# EAGLE design Daughter Board V2 (EAGLE 9.1.3)
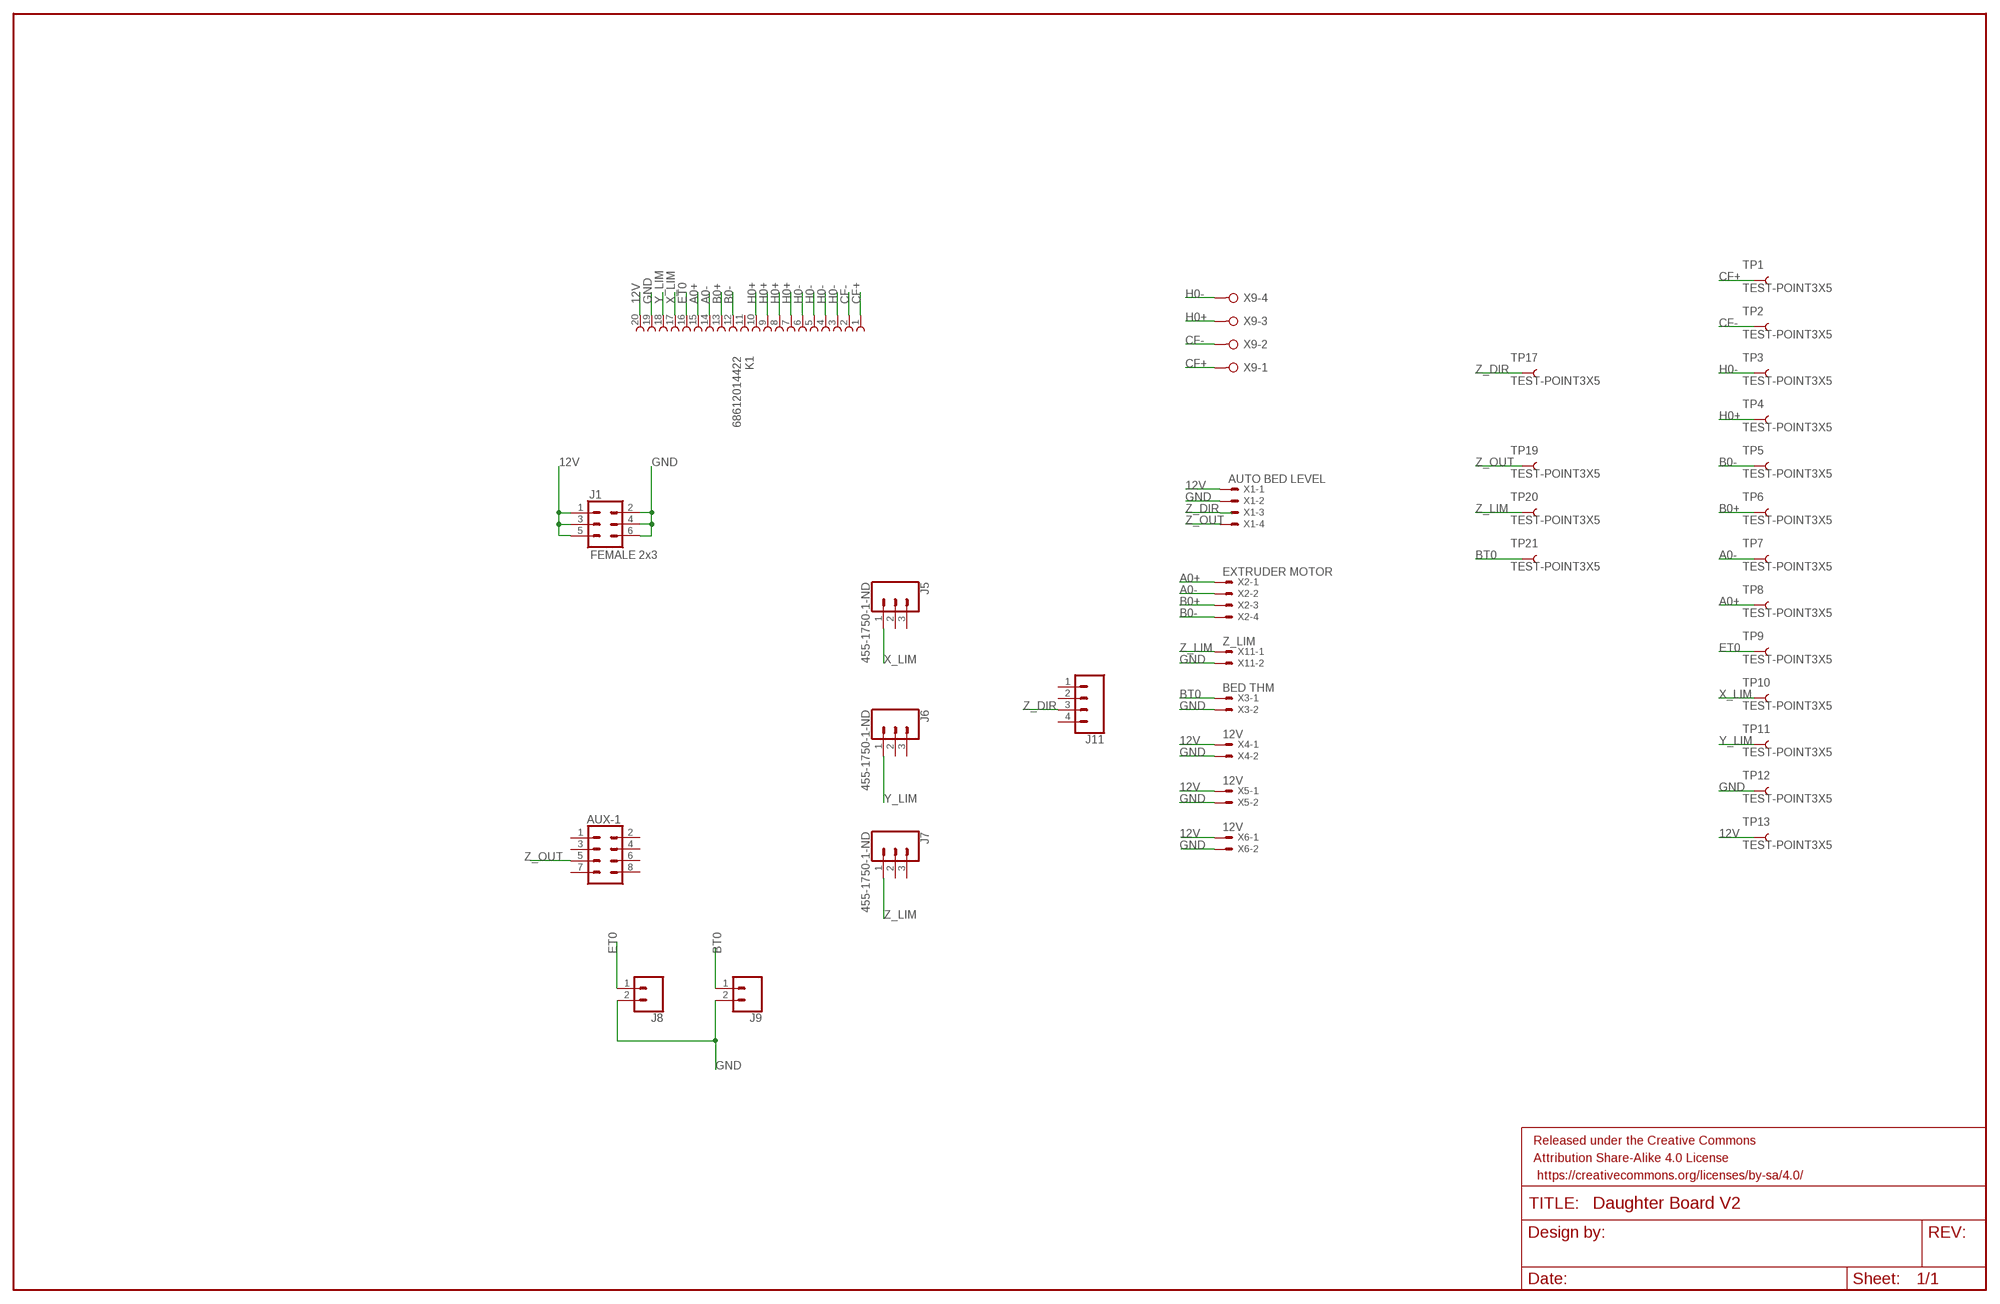
[diagram p0: schematic, sheet 1]

## Parts
AUX-1  CONN_04X2  [2X4]
FRAME1  FRAME-LEDGER  [CREATIVE_COMMONS]
J1  FEMALE 2x3  CONN_03X2FEMALE  [2X3]
J5  455-1750-1-ND  CONN_03  [1X03]
J6  455-1750-1-ND  CONN_03  [1X03]
J7  455-1750-1-ND  CONN_03  [1X03]
J8  CONN_02  [1X02]
J9  CONN_02  [1X02]
J11  CONN_04  [1X04]
K1  68612014422  [68612014422]
TP1  TEST-POINT3X5  [PAD.03X.05]
TP2  TEST-POINT3X5  [PAD.03X.05]
TP3  TEST-POINT3X5  [PAD.03X.05]
TP4  TEST-POINT3X5  [PAD.03X.05]
TP5  TEST-POINT3X5  [PAD.03X.05]
TP6  TEST-POINT3X5  [PAD.03X.05]
TP7  TEST-POINT3X5  [PAD.03X.05]
TP8  TEST-POINT3X5  [PAD.03X.05]
TP9  TEST-POINT3X5  [PAD.03X.05]
TP10  TEST-POINT3X5  [PAD.03X.05]
TP11  TEST-POINT3X5  [PAD.03X.05]
TP12  TEST-POINT3X5  [PAD.03X.05]
TP13  TEST-POINT3X5  [PAD.03X.05]
TP17  TEST-POINT3X5  [PAD.03X.05]
TP19  TEST-POINT3X5  [PAD.03X.05]
TP20  TEST-POINT3X5  [PAD.03X.05]
TP21  TEST-POINT3X5  [PAD.03X.05]
X1  AUTO BED LEVEL  JST-XH-04-PIN-LONG-PAD  [JST-XH-04-PACKAGE-LONG-PAD]
X2  EXTRUDER MOTOR  JST-XH-04-PIN-LONG-PAD  [JST-XH-04-PACKAGE-LONG-PAD]
X3  BED THM  JST-XH-02-PIN-LONG-PAD  [JST-XH-02-PACKAGE-LONG-PAD]
X4  12V  JST-XH-02-PIN-LONG-PAD  [JST-XH-02-PACKAGE-LONG-PAD]
X5  12V  JST-XH-02-PIN-LONG-PAD  [JST-XH-02-PACKAGE-LONG-PAD]
X6  12V  JST-XH-02-PIN-LONG-PAD  [JST-XH-02-PACKAGE-LONG-PAD]
X9  W237-04P  [W237-4P]
X11  Z_LIM  JST-XH-02-PIN-LONG-PAD  [JST-XH-02-PACKAGE-LONG-PAD]

## Nets
12V: J1.1 J1.3 J1.5 K1.20 TP13.P$1 X1.1 X4.1 X5.1 X6.1
A0+: K1.15 TP8.P$1 X2.1
A0-: K1.14 TP7.P$1 X2.2
B0+: K1.13 TP6.P$1 X2.3
B0-: K1.12 TP5.P$1 X2.4
BT0: J9.1 TP21.P$1 X3.1
CF+: K1.1 TP1.P$1 X9.1
CF-: K1.2 TP2.P$1 X9.2
ET0: J8.1 K1.16 TP9.P$1
GND: J1.2 J1.4 J1.6 J8.2 J9.2 K1.19 TP12.P$1 X1.2 X3.2 X4.2 X5.2 X6.2 X11.2
H0+: K1.7 K1.8 K1.9 K1.10 TP4.P$1 X9.3
H0-: K1.3 K1.4 K1.5 K1.6 TP3.P$1 X9.4
X_LIM: J5.1 K1.17 TP10.P$1
Y_LIM: J6.1 K1.18 TP11.P$1
Z_DIR: J11.3 TP17.P$1 X1.3
Z_LIM: J7.1 TP20.P$1 X11.1
Z_OUT: AUX-1.5 TP19.P$1 X1.4
Unconnected: AUX-1.1 AUX-1.2 AUX-1.3 AUX-1.4 AUX-1.6 AUX-1.7 AUX-1.8 J5.2 J5.3 J6.2 J6.3 J7.2 J7.3 J11.1 J11.2 J11.4 K1.11

## Library data of the parts
AUX-1 = SparkFun-Connectors:CONN_04X2: Multi connection point. Often used as Generic Header-pin footprint for 0.1 inch spaced/style header connections On any of the 0.1 inch spaced packages, you can populate with these: Break Away Headers - Straight <https://www.sparkfun.com/products/116> (PRT-00116) Break Away Male Headers - Right Angle <https://www.sparkfun.com/products/553> (PRT-00553) Female Headers <https://www.sparkfun.com/products/115> (PRT-00115) Break Away Headers - Machine Pin <https://www.sparkfun.com/products/117> (PRT-00117) Break Away Female Headers - Swiss Machine Pin <https://www.sparkfun.com/products/743> (PRT-00743)
FRAME1 = SparkFun-Aesthetics:FRAME-LEDGER: Schematic Frame - Ledger Standard 11x14 US Ledger frame
J1 = SparkFun-Connectors:CONN_03X2: Multi connection point. Often used as Generic Header-pin footprint for 0.1 inch spaced/style header connections You can populate with any combo of single row headers, but if you'd like an exact match, check these: Header - 2x3 (Male, 0.1") <https://www.sparkfun.com/products/12807> (PRT-12807) Header - 2x3 (Female, 0.1") <https://www.sparkfun.com/products/13010> (PRT-13010) 2x3 Pin Shrouded Header <https://www.sparkfun.com/products/10877> (PRT-10877) On any of the 0.1 inch spaced packages, you can populate with these: Break Away Headers - Straight <https://www.sparkfun.com/products/116> (PRT-00116) Break Away Male Headers - Right Angle <https://www.sparkfun.com/products/553> (PRT-00553) Female Headers <https://www.sparkfun.com/products/115> (PRT-00115) Break Away Headers - Machine Pin <https://www.sparkfun.com/products/117> (PRT-00117) Break Away Female Headers - Swiss Machine Pin <https://www.sparkfun.com/products/743> (PRT-00743) Special note: the shrouded connector mates well with our 3x2 ribbon cables: Ribbon Crimp Connector - 6-pin (2x3, Female) <https://www.sparkfun.com/products/10651> (PRT-10651) Ribbon Cable - 6 wire (15ft) <https://www.sparkfun.com/products/10646> (PRT-10646); PROD_ID: CONN-11566
J5-J7 = SparkFun-Connectors:CONN_03: Multi connection point. Often used as Generic Header-pin footprint for 0.1 inch spaced/style header connections On any of the 0.1 inch spaced packages, you can populate with these: Break Away Headers - Straight <https://www.sparkfun.com/products/116> (PRT-00116) Break Away Male Headers - Right Angle <https://www.sparkfun.com/products/553> (PRT-00553) Female Headers <https://www.sparkfun.com/products/115> (PRT-00115) Break Away Headers - Machine Pin <https://www.sparkfun.com/products/117> (PRT-00117) Break Away Female Headers - Swiss Machine Pin <https://www.sparkfun.com/products/743> (PRT-00743) Stackable Header - 3 Pin (Female, 0.1") <https://www.sparkfun.com/products/13875> (PRT-13875) For SCREWTERMINALS and SPRING TERMINALS visit here: Screw Terimnals on SparkFun.com <https://www.sparkfun.com/search/results?term=Screw+Terminals> (5mm/3.5mm/2.54mm spacing) This device is also useful as a general connection point to wire up your design to another part of your project. Our various solder wires solder well into these plated through hole pads. Hook-Up Wire - Assortment (Stranded, 22 AWG) <https://www.sparkfun.com/products/11375> (PRT-11375) Hook-Up Wire - Assortment (Solid Core, 22 AWG) <https://www.sparkfun.com/products/11367> (PRT-11367) View the entire wire category on our website here <https://www.sparkfun.com/categories/141> Special notes: Molex polarized connector foot print use with SKU : PRT-08232 with associated crimp pins and housings.; PROD_ID: XXX-00000
J8 J9 = SparkFun-Connectors:CONN_02: Multi connection point. Often used as Generic Header-pin footprint for 0.1 inch spaced/style header connections On any of the 0.1 inch spaced packages, you can populate with these: Break Away Headers - Straight <https://www.sparkfun.com/products/116> (PRT-00116) Break Away Male Headers - Right Angle <https://www.sparkfun.com/products/553> (PRT-00553) Female Headers <https://www.sparkfun.com/products/115> (PRT-00115) Break Away Headers - Machine Pin <https://www.sparkfun.com/products/117> (PRT-00117) Break Away Female Headers - Swiss Machine Pin <https://www.sparkfun.com/products/743> (PRT-00743) For SCREWTERMINALS and SPRING TERMINALS visit here: Screw Terimnals on SparkFun.com <https://www.sparkfun.com/search/results?term=Screw+Terminals> (5mm/3.5mm/2.54mm spacing) This device is also useful as a general connection point to wire up your design to another part of your project. Our various solder wires solder well into these plated through hole pads. Hook-Up Wire - Assortment (Stranded, 22 AWG) <https://www.sparkfun.com/products/11375> (PRT-11375) Hook-Up Wire - Assortment (Solid Core, 22 AWG) <https://www.sparkfun.com/products/11367> (PRT-11367) View the entire wire category on our website here <https://www.sparkfun.com/categories/141> Special notes: Molex polarized connector foot print use with: PRT-08233 with associated crimp pins and housings. 2.54_SCREWTERM for use with PRT-10571. 3.5mm Screw Terminal footprints for PRT-08084 5mm Screw Terminal footprints for use with PRT-08432
J11 = SparkFun-Connectors:CONN_04: Multi connection point. Often used as Generic Header-pin footprint for 0.1 inch spaced/style header connections On any of the 0.1 inch spaced packages, you can populate with these: Break Away Headers - Straight <https://www.sparkfun.com/products/116> (PRT-00116) Break Away Male Headers - Right Angle <https://www.sparkfun.com/products/553> (PRT-00553) Female Headers <https://www.sparkfun.com/products/115> (PRT-00115) Break Away Headers - Machine Pin <https://www.sparkfun.com/products/117> (PRT-00117) Break Away Female Headers - Swiss Machine Pin <https://www.sparkfun.com/products/743> (PRT-00743) For SCREWTERMINALS and SPRING TERMINALS visit here: Screw Terimnals on SparkFun.com <https://www.sparkfun.com/search/results?term=Screw+Terminals> (5mm/3.5mm/2.54mm spacing) This device is also useful as a general connection point to wire up your design to another part of your project. Our various solder wires solder well into these plated through hole pads. Hook-Up Wire - Assortment (Stranded, 22 AWG) <https://www.sparkfun.com/products/11375> (PRT-11375) Hook-Up Wire - Assortment (Solid Core, 22 AWG) <https://www.sparkfun.com/products/11367> (PRT-11367) View the entire wire category on our website here <https://www.sparkfun.com/categories/141> Special notes: Molex polarized connector foot print use with SKU : PRT-08231 with associated crimp pins and housings. 1MM SMD Version SKU: PRT-10208; PROD_ID: CONN-09696
K1 = Wurth_Elektronik_Electromechanic_FPC_Connectors_&_Flat_Flexible_Cable_rev15b:68612014422: WR-FPC 1.00mm SMT ZIF Horizontal Bottom Contact, 20 Pins=>Code : Con_FPC_ZIF_1.00_68612014422 <http://katalog.we-online.de/media/images/eican/Con_FPC_ZIF_1.00_6861xx14422_pf2.jpg> Details see: http://katalog.we-online.de/en/em/686_1xx_144_22 Created 2014-07-09, Karrer Zheng 2014 (C) Würth Elektronik
TP1-TP13 TP17 TP19-TP21 = SparkFun-Connectors:TEST-POINT: SparkFun Test Points Bare copper test points for troubleshooting or In-Circuit-Testing. These are used by our Production team for verifying production board runs using pogo-pins on test beds. SparkFun Products: SparkFun LSM9DS1 Breakout <https://www.sparkfun.com/products/13284> SparkFun PSOC <https://www.sparkfun.com/products/13714> SparkFun Load Cell Amplifier <https://www.sparkfun.com/products/13879>
X1 X2 = Rembrandt Electronics - JST XH Connectors v1-0:JST-XH-04-PIN: JST XH Connector 2 Pin Wire to board connector. Pitch: 2,54 mm, (0.100") Number of pins: 4 Created by Rembrandt Electronics www.rembrandtelectronics.com
X3-X6 X11 = Rembrandt Electronics - JST XH Connectors v1-0:JST-XH-02-PIN: JST XH Connector 2 Pin Wire to board connector. Pitch: 2,54 mm, (0.100") Number of pins: 2 Created by Rembrandt Electronics www.rembrandtelectronics.com
X9 = con-wago-508:W237-04P: WAGO SREW CLAMP; OC_FARNELL: unknown; OC_NEWARK: unknown

## Net classes
0 default: width 0.406 mm

## Board
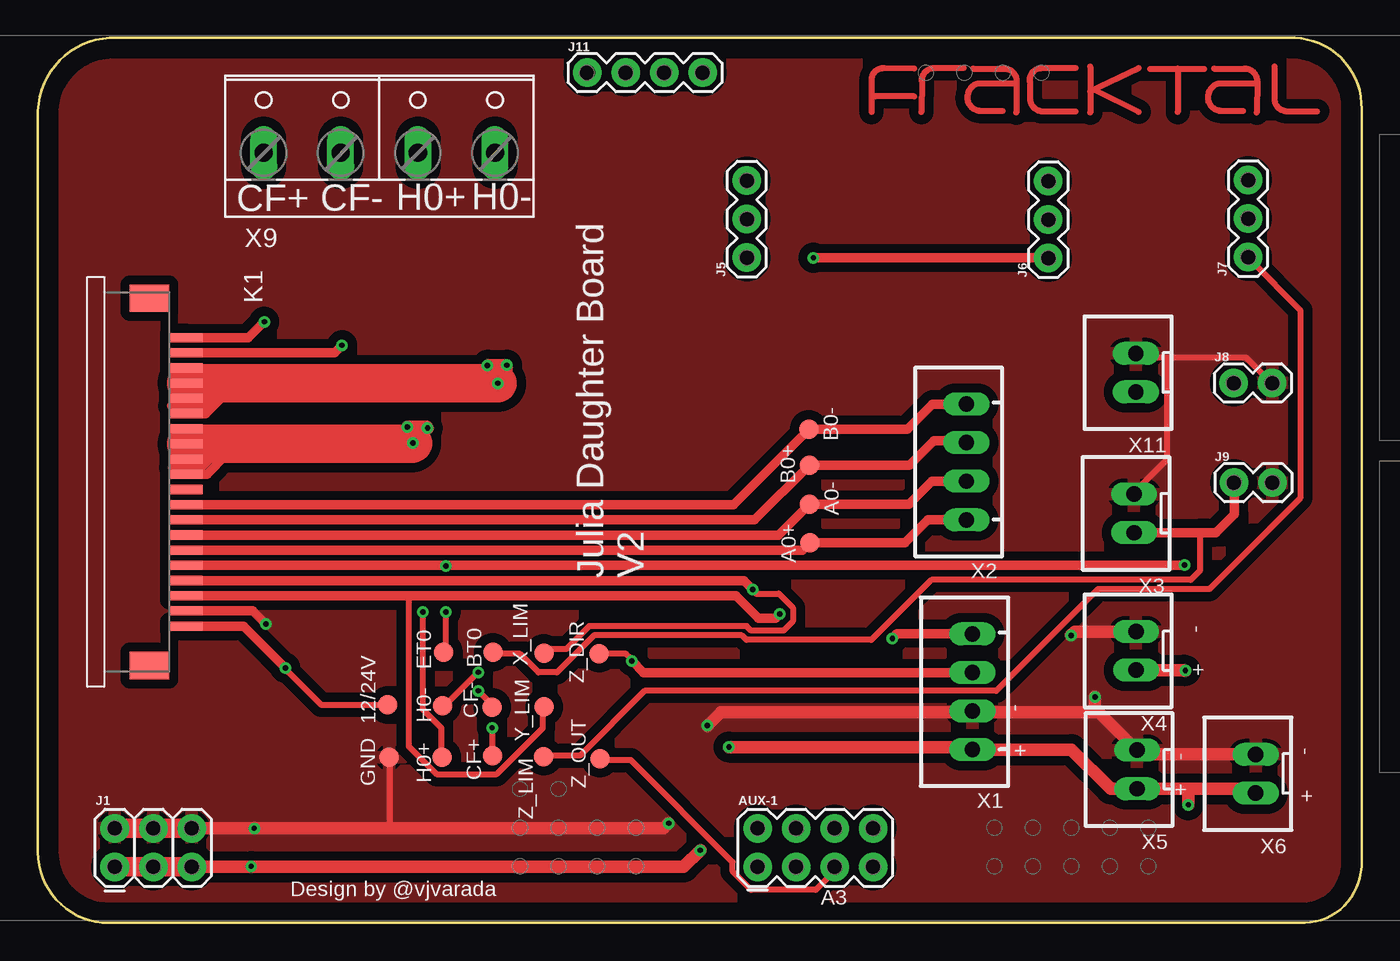
[diagram p1: board, top side]
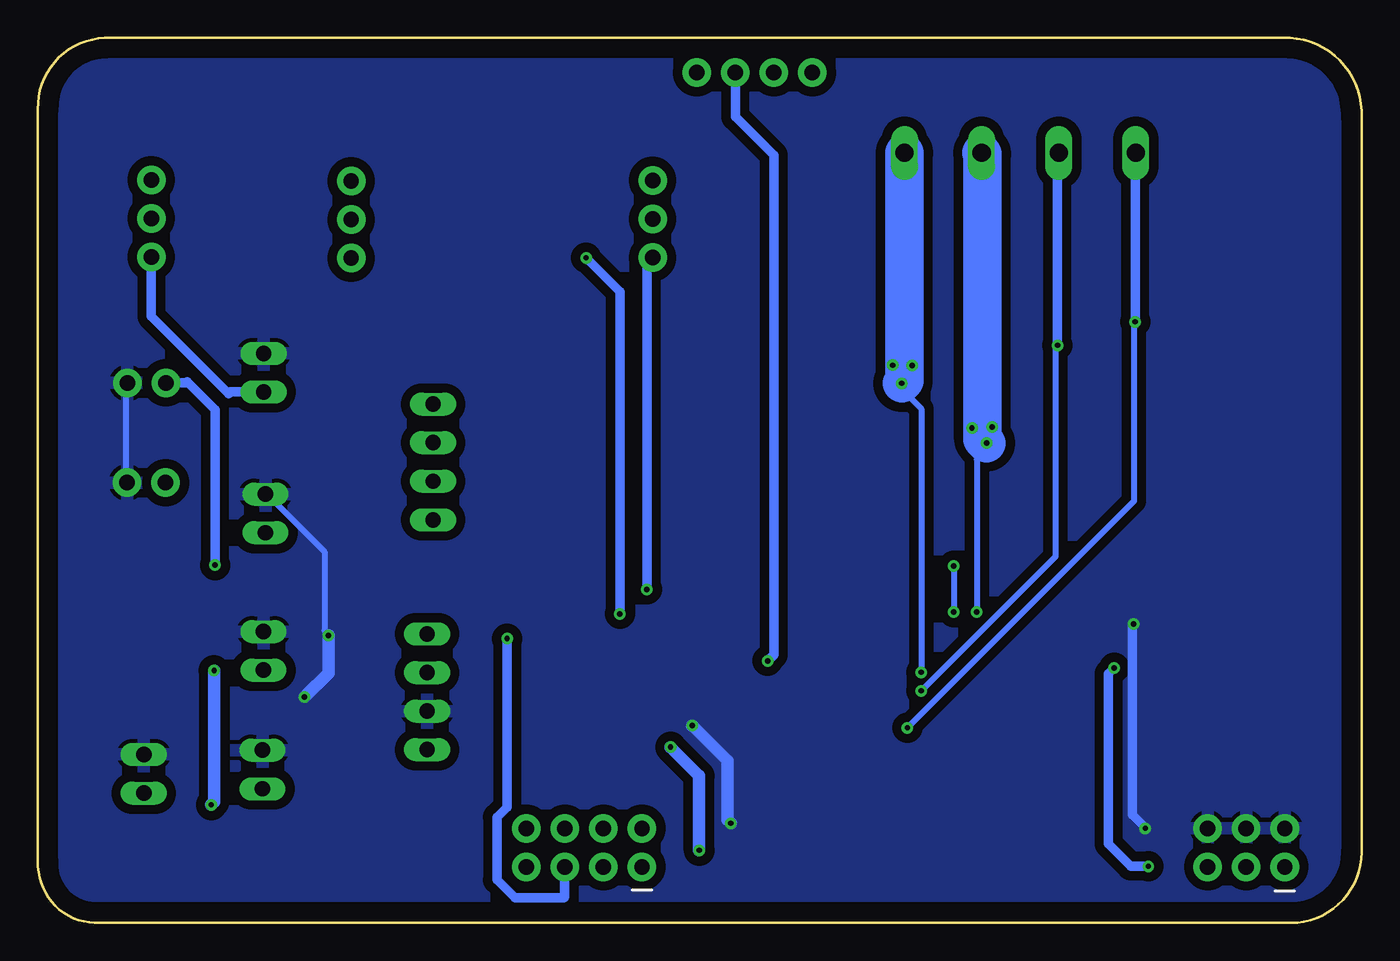
[diagram p2: board, bottom side, seen from below]

Size 87.21 x 58.29 mm. Coordinates in mm from the lower left corner, seen from the top.
Outline: 4.73,58.29 82.81,58.29 arc-90 87.21,53.59 87.21,4.06 arc-90 83.48,0 4.66,0 arc-90 0,4.66 0,53.05 arc-90 4.73,58.29
Copper layers (1*16): Top 0.035mm / dielectric 1.5mm / Bottom 0.035mm
Design rules "LionCircuits": minimum track width 8mil, minimum drill 0.35mm, track to track 8mil, track to pad 8mil, pad to pad 8mil, via to via 8mil, smd to smd 8mil, copper to edge 50mil, drill to drill 10mil, minimum pad ring 10mil, minimum via ring 8mil, stop-mask expansion 4mil, vias tented up to drill 0mil, thermal gap 10mil

### Footprints (pad centres in the part's own frame; a part is rotated, then mirrored left to right if it is on the bottom)
2X4 = drill 1.016 pad 1.88: 1 -3.81,-1.27; 2 -3.81,1.27; 3 -1.27,-1.27; 4 -1.27,1.27; 5 1.27,-1.27; 6 1.27,1.27; 7 3.81,-1.27; 8 3.81,1.27
2X3 = drill 1.016 pad 1.88: 1 0,0; 2 0,2.54; 3 2.54,0; 4 2.54,2.54; 5 5.08,0; 6 5.08,2.54
1X03 = drill 1.016 pad 1.88: 1 0,0; 2 2.54,0; 3 5.08,0
1X02 = drill 1.016 pad 1.88: 1 0,0; 2 2.54,0
1X04 = drill 1.016 pad 1.88: 1 0,0; 2 2.54,0; 3 5.08,0; 4 7.62,0
68612014422 = smd 0.6 x 2.2: 1 -15.77,1.1; 2 -14.77,1.1; 3 -13.77,1.1; 4 -12.77,1.1; 5 -11.77,1.1; 6 -10.77,1.1; 7 -9.77,1.1; 8 -8.77,1.1; 9 -7.77,1.1; 10 -6.77,1.1; 11 -5.77,1.1; 12 -4.77,1.1; 13 -3.77,1.1; 14 -2.77,1.1; 15 -1.77,1.1; 16 -0.77,1.1; 17 0.23,1.1; 18 1.23,1.1; 19 2.23,1.1; 20 3.23,1.1 | smd 1.8 x 2.6: Z1 -18.37,-1.3; Z2 5.83,-1.3
PAD.03X.05 = smd 1.27 x 1.27: P$1 0,0
JST-XH-04-PACKAGE-LONG-PAD = drill 1.016 long: 1 -3.81,0; 2 -1.27,0; 3 1.27,0; 4 3.81,0
JST-XH-02-PACKAGE-LONG-PAD = drill 1.016 long: 1 -1.27,0; 2 1.27,0
W237-4P = drill 1.194 long: 1 -7.62,-0.635; 2 -2.54,-0.635; 3 2.54,-0.635; 4 7.62,-0.635

### Placement (x,y rotation side)
AUX-1  51.22,4.97 0 top
FRAME1  22.01,-18.86 0 top  (outside the outline)
J1  5.06,3.7 0 top
J5  46.71,43.83 90 top
J6  66.58,43.79 90 top
J7  79.75,43.87 90 top
J8  78.78,35.57 0 top
J9  78.81,29.01 0 top
J11  36.19,56.01 0 top
K1  8.65,22.78 270 top
TP1  29.95,11.01 0 top
TP2  29.94,14.22 0 top
TP3  26.66,14.31 0 top
TP4  26.63,10.92 0 top
TP5  50.79,32.52 0 top
TP6  50.83,30.16 0 top
TP7  50.83,27.58 0 top
TP8  50.85,25.03 0 top
TP9  26.74,17.84 0 top
TP10  33.34,17.77 0 top
TP11  33.35,14.24 0 top
TP12  23.13,10.91 90 top
TP13  23.05,14.36 90 top
TP17  36.99,17.74 0 top
TP19  37.04,10.82 0 top
TP20  33.33,10.96 0 top
TP21  29.97,17.83 0 top
U$1  [FRACKTALLOGO]  66.92,53.3 0 top
X1  61.57,15.23 90 top
X2  61.18,30.37 90 top
X3  72.21,26.97 90 top
X4  72.35,17.92 90 top
X5  72.42,10.11 90 top
X6  80.24,9.83 90 top
X9  22.49,51.36 0 top
X11  72.34,36.25 90 top

### Tracks (layer width: path | path; a pad name or v marks a point on that pad's centre or on a via)
12V  (via drill 0.35)
  Top 0.406: TP13.P$1 22.91,14.38 18.65,14.38 16.51,16.51 v16.3,16.8
  Top 0.61: K1.20 13.55,19.55 v16.3,16.8 | v14.05,3.73 9.45,3.73 9.41,3.7
  Top 0.813: J1.5 42.55,3.7 v43.64,4.79 | v45.53,11.58 61.41,11.58 X1.1 68.1,11.42 70.68,8.84 X5.1 72.94,8.84 75.69,8.84 | 75.69,8.84 79.96,8.84 X6.1 | X4.1 75.5,16.65 75.53,16.62 v75.61,16.62 | v75.8,7.79 75.8,8.74 75.69,8.84
  Top 1.27: J1.1 J1.3 9.41,3.7 J1.5
  Bottom 0.61: v16.3,16.8 16.68,16.42 16.68,5.21 15.2,3.73 v14.05,3.73
  Bottom 0.813: v43.64,4.79 43.64,9.69 v45.53,11.58 | v75.61,16.62 75.61,7.98 v75.8,7.79
A0+
  Top 0.61: K1.15 50.38,24.55 TP8.P$1 57.11,25.03 58.65,26.57 61.17,26.57 X2.1
A0-
  Top 0.61: K1.14 48.8,25.55 TP7.P$1 57.39,27.58 58.89,29.08 61.17,29.08 X2.2
B0+
  Top 0.61: K1.13 47.22,26.55 TP6.P$1 57.42,30.16 59.03,31.78 61.04,31.78 X2.3
B0-
  Top 0.61: K1.12 45.82,27.55 TP5.P$1 57.29,32.53 58.94,34.18 X2.4
BT0
  Top 0.406: 76.56,25.71 76.56,23.22 75.95,22.61 58.88,22.61 54.92,18.64 46.69,18.64 46.38,18.95 36.63,18.95 34.19,16.51 32.97,16.51 31.75,17.73 30.23,17.73 TP21.P$1
  Top 0.61: X3.1 76.56,25.71 77.61,25.71 78.84,26.94 78.84,28.97 J9.1
CF+  (via drill 0.35)
  Top 0.406: v29.92,12.85 29.92,11.02 TP1.P$1
  Top 0.61: K1.1 13.87,38.55 v14.91,39.6
  Bottom 0.406: v29.92,12.85 14.99,27.79 14.99,39.37 v14.91,39.6
  Bottom 0.61: v14.91,39.6 14.91,50.69 X9.1
CF-  (via drill 0.35)
  Top 0.406: v29.01,15.29 29.92,14.38 TP2.P$1
  Top 0.61: K1.2 19.54,37.55 v20.03,38.05
  Bottom 0.406: v29.01,15.29 20.17,24.13 20.17,37.85 v20.03,38.05
  Bottom 0.61: v20.03,38.05 20.03,50.65 X9.2
ET0  (via drill 0.35)
  Top 0.406: v26.88,20.47 26.88,18.03 TP9.P$1 | v26.88,23.52 26.88,23.55
  Top 0.61: K1.16 26.88,23.55 75.52,23.55 v75.54,23.57
  Bottom 0.406: v26.88,23.52 v26.88,20.47
  Bottom 0.61: v75.54,23.57 75.54,33.79 77.38,35.64 77.45,35.57 J8.1
GND  (via drill 0.35)
  Top 0.406: 74.42,37.24 79.61,37.24 81.13,35.71 J8.2 | 74.42,37.24 72.6,37.24 X11.2 | 23.22,6.24 23.22,10.72 TP12.P$1 | 74.42,37.24 74.42,30.53 72.29,28.4 X3.2
  Top 0.61: J1.6 10.66,6.24 | K1.19 14.16,20.55 v15.03,19.69 | v14.25,6.24 9.15,6.24
  Top 0.813: J1.6 23.22,6.24 41.23,6.24 v41.56,6.57 | 61.51,13.89 45,13.89 v44.11,13.01 | 61.51,13.89 X1.2 | X6.2 72.7,11.1 X5.2 69.9,13.89 69.5,13.89 | 69.5,13.89 61.51,13.89 | X4.2 68.33,19.19 v68.07,18.94 | v69.65,14.88 69.65,14.05 69.5,13.89
  Top 1.27: J1.2 J1.4 9.15,6.24 J1.6
  Bottom 0.406: J9.2 81.44,29.31 81.44,35.41 J8.2 | v68.07,18.94 68.33,19.25 68.33,24.44 71.99,28.09 X3.2
  Bottom 0.61: 81.32,29.03 J9.2 | v15.03,19.69 15.09,19.62 15.09,7.12 14.25,6.29 v14.25,6.24
  Bottom 0.813: v41.56,6.57 41.79,6.79 41.79,10.69 44.1,13.01 v44.11,13.01 | v68.07,18.94 68.07,16.46 v69.65,14.88
  pour Bottom (isolate 0.61): -0.07,54.04 arc-90 4.03,58.14 83.04,58.14 arc-90 86.96,54.22 86.96,3.63 arc-90 83.38,0.05 5.71,0.05 arc-90 -0.04,5.79 -0.04,54.06
  pour Top (isolate 0.61): -0.2,54.41 arc-90 3.52,58.13 83.34,58.13 arc-90 87.19,54.28 87.19,2.96 arc-90 84.23,0 5.3,0 arc-90 -0.25,5.55 -0.25,54.31
H0+  (via drill 0.35)
  Top 0.406: v25.35,20.47 25.35,14.07 26.57,12.85 26.57,11.02 TP4.P$1
  Top 0.61: K1.10 9.75,29.88 | 9.75,29.88 K1.8 | K1.8 K1.7 | K1.9 K1.8 | K1.10 9.31,30 8.88,30 9.75,30.87 K1.8 | K1.8 9.75,30.88 10.68,29.95 | K1.10 10.29,29.55 10.68,29.95 | 10.68,29.95 9.81,29.95 9.75,29.88 | K1.10 11.14,29.55 12.45,30.86 | 11.8,31.55 11.8,31.06 10.68,29.95
  Top 0.813: v24.35,32.68 25.59,32.68 v25.67,32.6 25.67,32.58 24.65,31.55
  Top 2.54: K1.8 11.8,31.55 24.65,31.55 v24.7,31.61
  Bottom 0.406: v25.35,20.47 25.35,30.53 v24.7,31.61
  Bottom 2.54: X9.3 24.97,50.66 24.97,31.88 v24.7,31.61
H0-  (via drill 0.35)
  Top 0.406: v29.01,16.51 26.88,14.38 TP3.P$1
  Top 0.61: 9.75,34.01 K1.6 10.79,33.55 | 9.75,34.01 K1.5 | 9.75,34.01 10.59,34.01 10.62,34.04 | 10.62,34.04 9.75,34.9 K1.4 K1.3 | 9.75,34.01 9.7,34.06 8.82,34.06 | 10.79,33.55 11.06,33.55 12.58,35.07 | 11.85,35.55 11.85,35.27 | 11.85,35.27 10.62,34.04 | 11.85,35.27 11.85,34.62 10.79,33.55
  Top 0.813: v29.62,36.72 29.64,36.74 v30.89,36.74 30.89,36.16 v30.29,35.55
  Top 2.54: K1.4 11.85,35.55 v30.29,35.55
  Bottom 0.406: v29.01,16.51 29.01,33.88 29.62,34.49 v30.29,35.55
  Bottom 2.54: X9.4 30.13,50.71 30.13,35.71 v30.29,35.55
X_LIM  (via drill 0.35)
  Top 0.406: TP10.P$1 33.58,18.03 34.8,18.03 36.32,19.56 46.69,19.56 46.99,19.25 49.13,19.25 49.74,19.86 49.74,20.78 48.82,21.69 47.3,21.69 v47.09,21.97
  Top 0.61: K1.17 46.51,22.55 v47.09,21.97
  Bottom 0.61: v47.09,21.97 47.09,43.45 J5.1
Y_LIM  (via drill 0.35)
  Top 0.406: 24.44,21.55 24.44,11.63 26.27,9.8 30.23,9.8 33.28,12.85 33.28,14.07 TP11.P$1
  Top 0.61: K1.18 24.44,21.55 46,21.55 47.48,20.08 48.59,20.08 v48.87,20.36 | v51.09,43.82 66.55,43.82 J6.1
  Bottom 0.61: v48.87,20.36 48.87,41.59 v51.09,43.82
Z_DIR  (via drill 0.35)
  Top 0.406: TP17.P$1 37.24,17.73 38.76,17.73 39.07,17.42 v39.13,17.26
  Top 0.61: v39.13,17.26 39.89,16.5 X1.3
  Bottom 0.61: v39.13,17.26 38.72,17.67 38.72,50.57 41.25,53.1 41.25,55.99 J11.3
Z_LIM
  Top 0.406: TP20.P$1 33.58,11.02 35.72,11.02 39.98,15.29 63.15,15.29 69.85,22 77.19,22 83.18,27.98 83.18,40.37 79.91,43.64 J7.1
  Bottom 0.61: J7.1 79.75,39.95 74.65,34.86 74.54,34.98 X11.1
Z_OUT  (via drill 0.35)
  Top 0.406: TP19.P$1 37.24,10.72 39.07,10.72 45.77,4.01 45.77,3.4 46.99,2.18 51.26,2.18 52.48,3.4 AUX-1.5
  Top 0.61: X1.4 56.61,19.04 v56.3,18.73
  Bottom 0.61: v56.3,18.73 56.3,7.63 56.96,6.97 56.96,2.85 55.77,1.65 52.56,1.65 52.5,1.7 52.5,3.68 AUX-1.5

### Text on the board
tNames: CF+ | CF- | H0+ | H0- | B0- | B0+ | A0- | A0+ | Julia Daughter Board / V2 | - | ET0 | BT0 | X_LIM | Z_DIR | + | CF- | - | 12/24V | H0- | Y_LIM | + | - | - | CF+ | GND | H0+ | Z_OUT | + | + | Z_LIM | Design by @vjvarada | A3